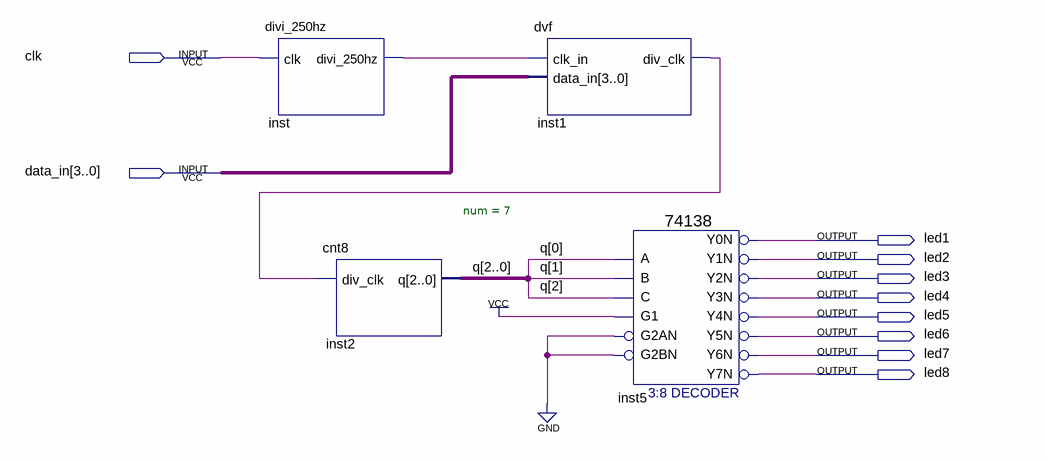
[diagram p0: schematic sheet]
// Quartus schematic Run8.bdf as structural Verilog: 4 symbols, 10 pins
module Run8 (
  input  clk,
  input  [3:0] data_in,
  output led1,
  output led2,
  output led3,
  output led4,
  output led5,
  output led6,
  output led7,
  output led8
);

  wire inst1_div_clk, inst_divi_250hz;
  wire [2:0] q;

  divi_250hz inst (.clk(clk), .divi_250hz(inst_divi_250hz));
  cnt8 #(.num(7)) inst2 (.div_clk(inst1_div_clk), .q(q));
  dvf inst1 (.clk_in(inst_divi_250hz), .data_in(data_in), .div_clk(inst1_div_clk));
  \74138  inst5 (
    .A(q[0]), .B(q[1]), .G1(1'b1), .C(q[2]), .G2AN(1'b0), .G2BN(1'b0), .Y0N(led1), .Y1N(led2), .Y2N(led3),
    .Y3N(led4), .Y4N(led5), .Y5N(led6), .Y6N(led7), .Y7N(led8));
endmodule
